# Altium schematic sheet PDB_Route.SchDoc
size A4
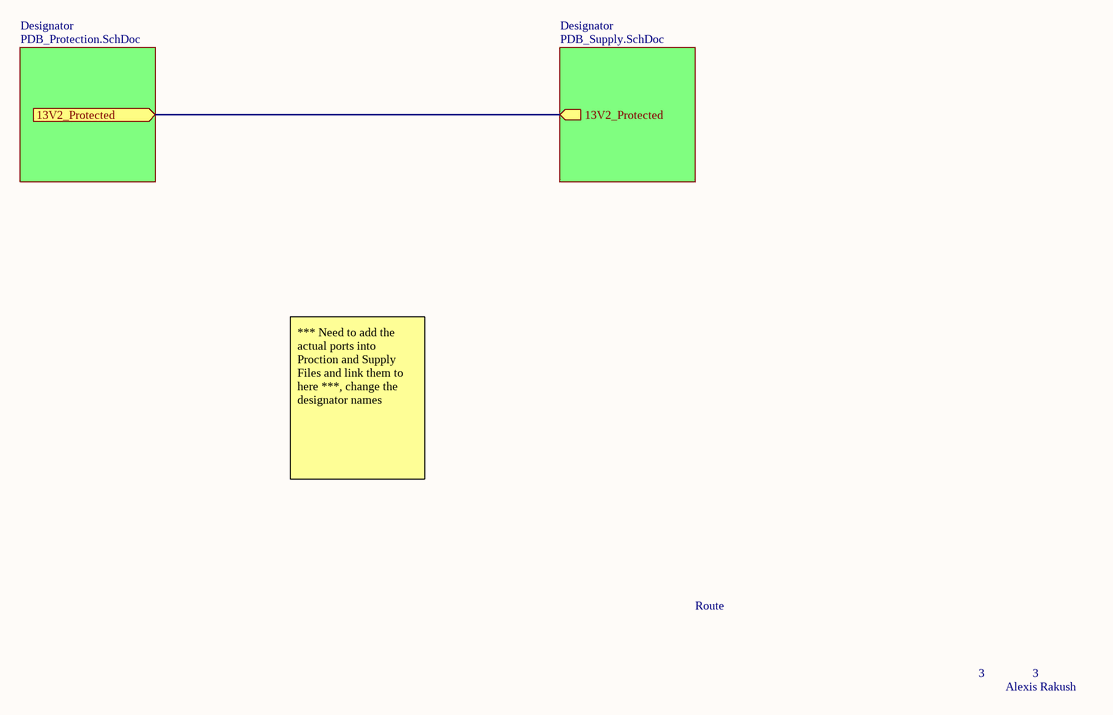
[diagram p0: PDB_Route.SchDoc]

## Sub-sheets
Designator = PDB_Protection.SchDoc: no entries
Designator = PDB_Supply.SchDoc: 13V2_Protected (out)

## Ports
13V2_Protected (in)

## Nets
13V2_Protected: port 13V2_Protected, sheet Designator/13V2_Protected

## Notes on the sheet
- *** Need to add the actual ports into Proction and Supply Files and link them to here ***, change the designator names
- Route
- 3
- Alexis Rakush